# Altium schematic sheet VoltageSense.SchDoc
size A; SheetNumber: 2; SheetTotal: 10
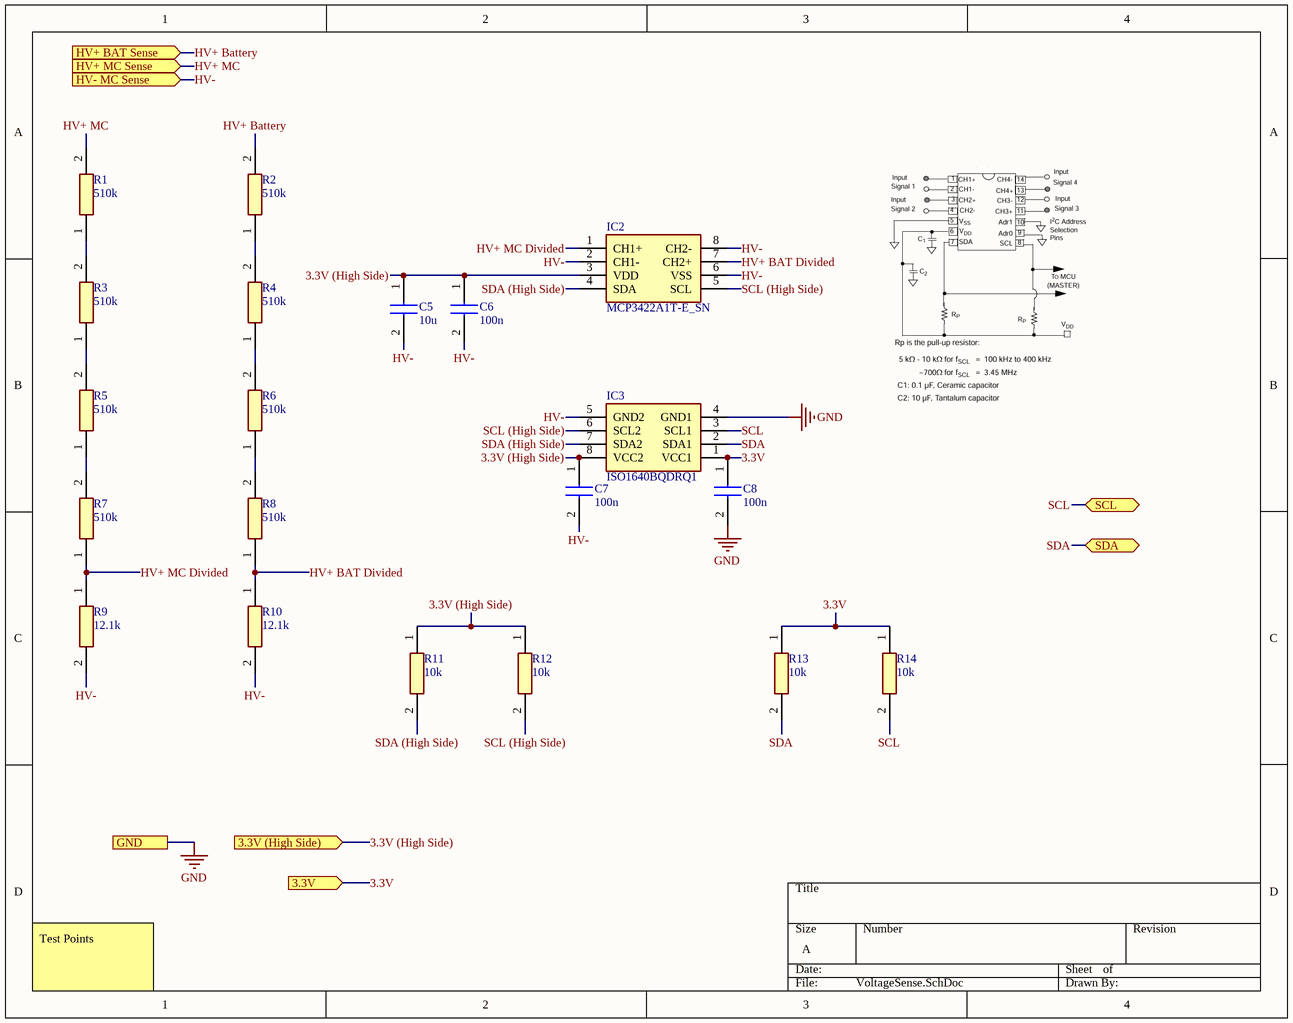
[diagram p0: VoltageSense.SchDoc]

## Parts
C5  10u  [CAPC1608X90N]
C6  100n  [CAPC1608X90N]
C7  100n  [CAPC3216X94N]
C8  100n  [CAPC3216X94N]
IC2  MCP3422A1T-E_SN  [SOIC127P600X175-8N]
IC3  ISO1640BQDRQ1  [SOIC127P600X175-8N]
R1  510k  [RESC3216X75N]
R2  510k  [RESC3216X75N]
R3  510k  [RESC3216X75N]
R4  510k  [RESC3216X75N]
R5  510k  [RESC3216X75N]
R6  510k  [RESC3216X75N]
R7  510k  [RESC3216X75N]
R8  510k  [RESC3216X75N]
R9  12.1k  [ERJS08_U08_(1206)]
R10  12.1k  [ERJS08_U08_(1206)]
R11  10k  [RESC1608X55N]
R12  10k  [RESC1608X55N]
R13  10k  [RESC1608X55N]
R14  10k  [RESC1608X55N]

## Ports
3.3V (High Side) (in), 3.3V (in), GND, HV+ BAT Sense (in), HV+ MC Sense (in), HV- MC Sense (in), SCL (bidir), SDA (bidir)

## Nets
GND: C8.2 IC3.4(GND1) ; port GND
3.3V: C8.1 IC3.1(VCC1) R13.1 R14.1 ; port 3.3V
3.3V (High Side): C5.1 C6.1 C7.1 IC2.3(VDD) IC3.8(VCC2) R11.1 R12.1 ; port 3.3V (High Side)
HV+ BAT Divided: IC2.7(CH2+) R8.1 R10.1
HV+ Battery: R2.2 ; port HV+ BAT Sense
HV+ MC: R1.2 ; port HV+ MC Sense
HV+ MC Divided: IC2.1(CH1+) R7.1 R9.1
HV-: C5.2 C6.2 C7.2 IC2.2(CH1-) IC2.6(VSS) IC2.8(CH2-) IC3.5(GND2) R9.2 R10.2 ; port HV- MC Sense
SCL: IC3.3(SCL1) R14.2 ; port SCL
SCL (High Side): IC2.5(SCL) IC3.6(SCL2) R12.2
SDA: IC3.2(SDA1) R13.2 ; port SDA
SDA (High Side): IC2.4(SDA) IC3.7(SDA2) R11.2
NetR1_1: R1.1 R3.2
NetR2_1: R2.1 R4.2
NetR3_1: R3.1 R5.2
NetR4_1: R4.1 R6.2
NetR5_1: R5.1 R7.2
NetR6_1: R6.1 R8.2

## Notes on the sheet
- Test Points

## Library data of the parts
C5 = CL10A106KQ8NNNL: Capacitor; Manufacturer_Name: SAMSUNG; Datasheet Link: https://product.samsungsem.com/mlcc/basic-search.do?partNumber=CL10A106KQ8NNN; Height: 0.9mm; Manufacturer_Part_Number: CL10A106KQ8NNNL; Mouser Part Number: N/A; Mouser Price/Stock: https://www.mouser.com/Search/Refine.aspx?Keyword=N%2FA; Arrow Part Number: CL10A106KQ8NNNL; Arrow Price/Stock: https://www.arrow.com/en/products/cl10a106kq8nnnl/samsung-electro-mechanics
C6 = 06035C104J4Z2A: Capacitor; Manufacturer_Name: Kyocera AVX; Datasheet Link: https://componentsearchengine.com/Datasheets/1/06031A100FAT2A.pdf; Height: 0.9mm; Manufacturer_Part_Number: 06035C104J4Z2A; Mouser Part Number: 581-06035C104J4Z2A; Mouser Price/Stock: https://www.mouser.co.uk/ProductDetail/KYOCERA-AVX/06035C104J4Z2A?qs=Awwwc1gvTnlncvTGCFZvkw%3D%3D; Arrow Part Number: 06035C104J4Z2A; Arrow Price/Stock: https://www.arrow.com/en/products/06035c104j4z2a/avx
C7 C8 = 12065C104J4Z2A: Capacitor; Manufacturer_Name: Kyocera AVX; Datasheet Link: https://spicat.kyocera-avx.com/product/mlcc/chartview/12065C104J4Z2A/DataSheet/X7R; Height: 0.94mm; Manufacturer_Part_Number: 12065C104J4Z2A; Mouser Part Number: 581-12065C104J4Z2A; Mouser Price/Stock: https://www.mouser.com/Search/Refine.aspx?Keyword=581-12065C104J4Z2A
IC2 = MCP3422A1T-E_SN: Integrated Circuit; Manufacturer_Name: Microchip; Manufacturer_Part_Number: MCP3422A1T-E/SN; Datasheet Link: https://ww1.microchip.com/downloads/en/DeviceDoc/22088c.pdf; Height: 1.75mm; Mouser Part Number: 579-MCP3422A1T-E/SN; Mouser Price/Stock: https://www.mouser.co.uk/ProductDetail/Microchip-Technology/MCP3422A1T-E-SN?qs=X98pPdo4MrvBbe3HwfJ%252Bfw%3D%3D; Arrow Part Number: MCP3422A1T-E/SN; Arrow Price/Stock: https://www.arrow.com/en/products/mcp3422a1t-esn/microchip-technology
IC3 = ISO1640BQDRQ1: Integrated Circuit; Manufacturer_Name: Texas Instruments; Datasheet Link: https://www.ti.com/lit/ds/symlink/iso1640.pdf; Height: 1.75mm; Manufacturer_Part_Number: ISO1640BQDRQ1; Mouser Part Number: 595-ISO1640BQDRQ1; Mouser Price/Stock: https://www.mouser.co.uk/ProductDetail/Texas-Instruments/ISO1640BQDRQ1?qs=QNEnbhJQKvat3Z1mRPODGw%3D%3D; Arrow Part Number: ISO1640BQDRQ1; Arrow Price/Stock: https://www.arrow.com/en/products/iso1640bqdrq1/texas-instruments?region=nac
R1-R8 = CR1206-FX-5103ELF: Resistor; Manufacturer_Name: Bourns; Datasheet Link: http://componentsearchengine.com/Datasheets/1/CR1206-FX-5103ELF.pdf; Height: 0.75mm; Manufacturer_Part_Number: CR1206-FX-5103ELF; Mouser Part Number: 652-CR1206FX-5103ELF; Mouser Price/Stock: https://www.mouser.co.uk/ProductDetail/Bourns/CR1206-FX-5103ELF?qs=O4EQhShwvrpqwloF6Ll%2FVg%3D%3D; Arrow Part Number: CR1206-FX-5103ELF; Arrow Price/Stock: https://www.arrow.com/en/products/cr1206-fx-5103elf/bourns?region=europe
R9 R10 = ERJ-S08F1212V: Resistor; Manufacturer_Name: Panasonic; Datasheet Link: http://industrial.panasonic.com/cdbs/www-data/pdf/RDP0000/AOA0000C334.pdf; Height: 0.7mm; Manufacturer_Part_Number: ERJ-S08F1212V; Mouser Part Number: 667-ERJ-S08F1212V; Mouser Price/Stock: https://www.mouser.co.uk/ProductDetail/Panasonic/ERJ-S08F1212V?qs=Zyl8A9hlmJoa%2FmRL4TNL9g%3D%3D
R11-R14 = CRGCQ0603F10K: Resistor; Manufacturer_Name: TE Connectivity; Datasheet Link: https://www.te.com/commerce/DocumentDelivery/DDEController?Action=showdoc&DocId=Data+Sheet%7F1773204-3%7F1%7Fpdf%7FEnglish%7FENG_DS_1773204-3_1.pdf%7F5-2176339-2; Height: 0.55mm; Manufacturer_Part_Number: CRGCQ0603F10K; Mouser Part Number: 279-CRGCQ0603F10K; Mouser Price/Stock: https://www.mouser.co.uk/ProductDetail/TE-Connectivity-Holsworthy/CRGCQ0603F10K?qs=wUXugUrL1qxhM765MzQWJg%3D%3D; Arrow Part Number: CRGCQ0603F10K; Arrow Price/Stock: https://www.arrow.com/en/products/crgcq0603f10k/te-connectivity?region=nac